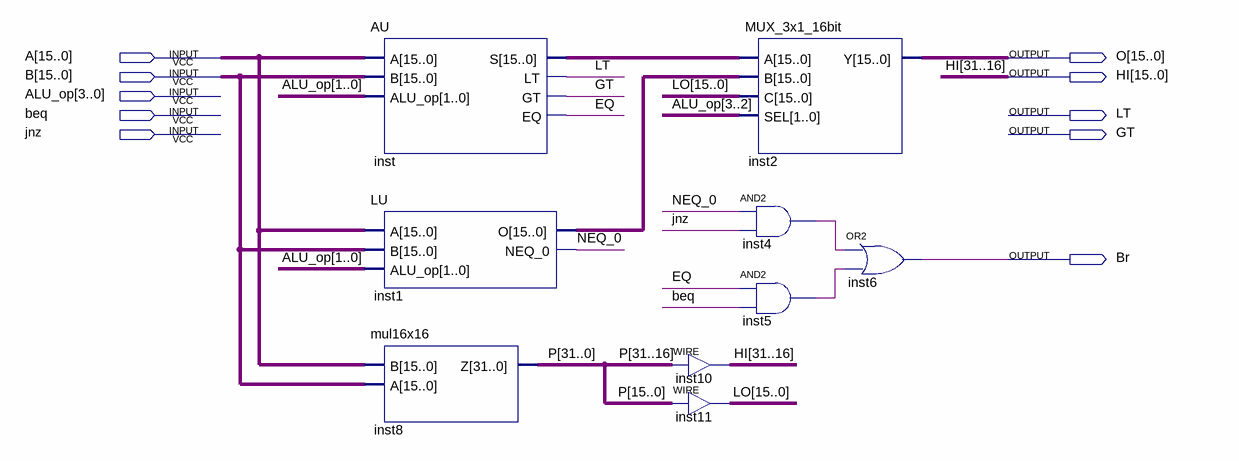
[diagram p0: schematic sheet]
// Quartus schematic ALU.bdf as structural Verilog: 9 symbols, 10 pins
module ALU (
  input  [15:0] A,
  input  [15:0] B,
  input  [3:0] ALU_op,
  input  beq,
  input  jnz,
  output [15:0] O,
  output [15:0] HI,
  output LT,
  output GT,
  output Br
);

  wire EQ, inst4_out, inst5_out, NEQ_0;
  wire [15:0] inst1_o, inst_s, LO;
  wire [31:0] P;

  AU inst (.A(A), .B(B), .ALU_op(ALU_op[1:0]), .S(inst_s), .LT(LT), .GT(GT), .EQ(EQ));
  LU inst1 (.A(A), .B(B), .ALU_op(ALU_op[1:0]), .O(inst1_o), .NEQ_0(NEQ_0));
  mul16x16 inst8 (.B(A), .A(B), .Z(P));
  assign HI = P[31:16];  // WIRE inst10
  assign LO = P[15:0];  // WIRE inst11
  MUX_3x1_16bit inst2 (.A(inst_s), .B(inst1_o), .C(LO), .SEL(ALU_op[3:2]), .Y(O));
  and inst4 (inst4_out, NEQ_0, jnz);
  and inst5 (inst5_out, EQ, beq);
  or inst6 (Br, inst4_out, inst5_out);

  // Other names for the same wires on the sheet: HI[31:16] = HI
endmodule
